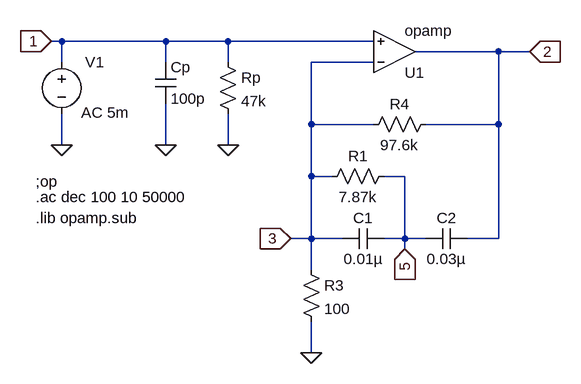
[diagram p0: schematic OP27 Preamp.asc]
OP27 Preamp.asc, the LTspice schematic file:
Version 4
SHEET 1 1876 1124
WIRE -272 176 -288 176
WIRE -112 176 -272 176
WIRE -16 176 -112 176
WIRE 208 176 -16 176
WIRE 400 192 272 192
WIRE 448 192 400 192
WIRE -272 208 -272 176
WIRE -112 208 -112 176
WIRE -16 208 -16 176
WIRE 208 208 112 208
WIRE 112 304 112 208
WIRE 208 304 112 304
WIRE 400 304 400 192
WIRE 400 304 288 304
WIRE -272 336 -272 288
WIRE -112 336 -112 272
WIRE -16 336 -16 288
WIRE 112 384 112 304
WIRE 144 384 112 384
WIRE 256 384 224 384
WIRE 112 480 112 384
WIRE 112 480 80 480
WIRE 160 480 112 480
WIRE 256 480 256 384
WIRE 256 480 224 480
WIRE 288 480 256 480
WIRE 400 480 400 304
WIRE 400 480 352 480
WIRE 256 496 256 480
WIRE 112 528 112 480
WIRE 112 656 112 608
FLAG -272 336 0
FLAG 112 656 0
FLAG -288 176 1
IOPIN -288 176 In
FLAG 80 480 3
IOPIN 80 480 In
FLAG 256 496 5
IOPIN 256 496 In
FLAG -112 336 0
FLAG -16 336 0
FLAG 448 192 2
IOPIN 448 192 In
SYMBOL voltage -272 192 R0
WINDOW 3 24 44 Left 2
WINDOW 123 30 94 Left 2
WINDOW 0 36 16 Left 2
WINDOW 39 0 0 Left 2
SYMATTR Value ""
SYMATTR Value2 AC 5m
SYMATTR InstName V1
SYMBOL cap 160 496 R270
WINDOW 0 32 32 VTop 2
WINDOW 3 0 32 VBottom 2
SYMATTR InstName C1
SYMATTR Value 0.01µ
SYMBOL res 96 512 R0
SYMATTR InstName R3
SYMATTR Value 100
SYMBOL res 128 400 R270
WINDOW 0 32 56 VTop 2
WINDOW 3 0 56 VBottom 2
SYMATTR InstName R1
SYMATTR Value 7.87k
SYMBOL cap -128 208 R0
SYMATTR InstName Cp
SYMATTR Value 100p
SYMBOL res -32 192 R0
SYMATTR InstName Rp
SYMATTR Value 47k
SYMBOL OpAmps\\opamp 240 256 M180
SYMATTR InstName U1
SYMBOL cap 288 496 R270
WINDOW 0 32 32 VTop 2
WINDOW 3 0 32 VBottom 2
SYMATTR InstName C2
SYMATTR Value 0.03µ
SYMBOL res 192 320 R270
WINDOW 0 32 56 VTop 2
WINDOW 3 0 56 VBottom 2
SYMATTR InstName R4
SYMATTR Value 97.6k
TEXT -312 392 Left 2 !;op
TEXT -312 416 Left 2 !.ac dec 100 10 50000
TEXT -312 448 Left 2 !.lib opamp.sub

The netlist it stands for:
* OP27 Preamp.asc
V1 1 0 AC 5m
C1 3 5 0.01µ
R3 3 0 100
R1 3 5 7.87k
Cp 1 0 100p
Rp 1 0 47k
XU1 3 1 2 opamp Aol=100K GBW=10Meg  ; pins invin noninvin out
C2 5 2 0.03µ
R4 3 2 97.6k
;op
.ac dec 100 10 50000
.lib opamp.sub
.backanno
.end